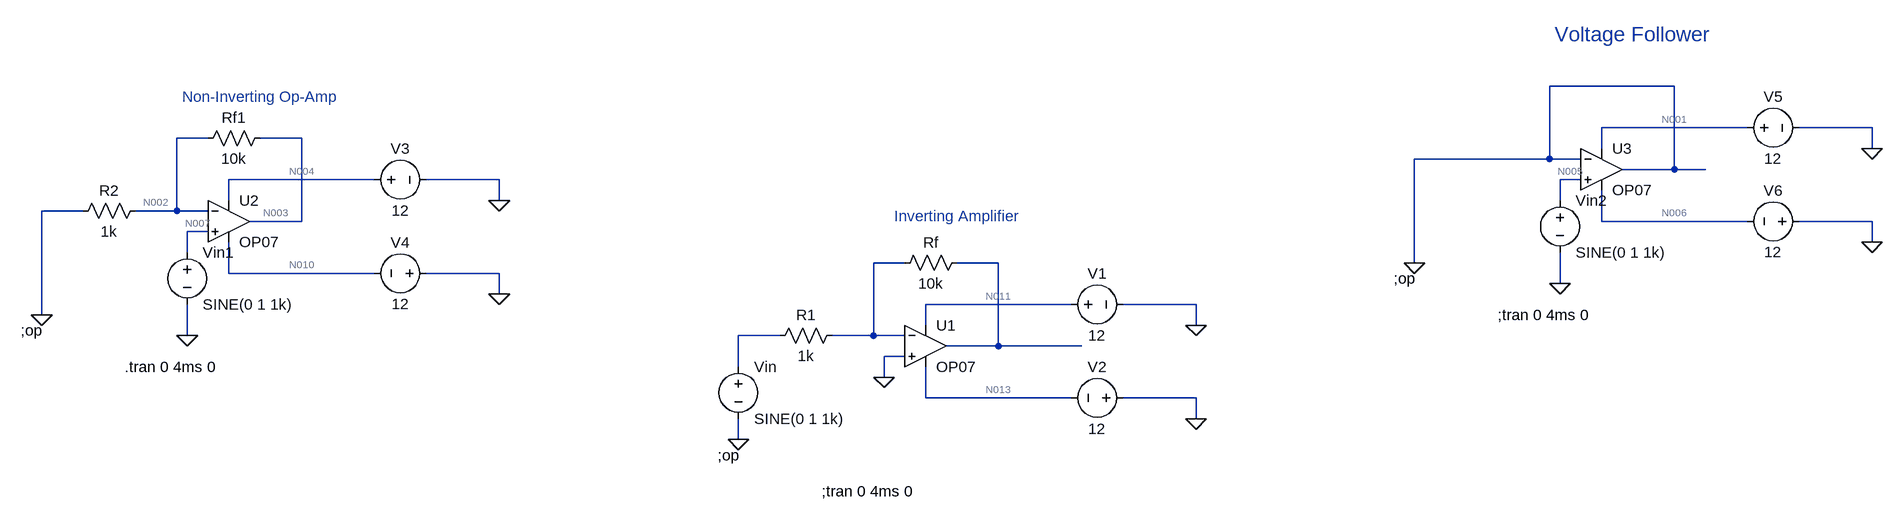
[diagram p0: schematic Exp2.asc]
Exp2.asc, the LTspice schematic file:
Version 4
SHEET 1 1700 680
WIRE 1376 -208 1184 -208
WIRE 1488 -144 1264 -144
WIRE 1680 -144 1568 -144
WIRE -880 -128 -928 -128
WIRE -736 -128 -800 -128
WIRE 1264 -112 1264 -144
WIRE 1680 -112 1680 -144
WIRE 1184 -96 1184 -208
WIRE 1184 -96 976 -96
WIRE 1232 -96 1184 -96
WIRE 1376 -80 1376 -208
WIRE 1376 -80 1296 -80
WIRE 1424 -80 1376 -80
WIRE -624 -64 -848 -64
WIRE -432 -64 -544 -64
WIRE 1232 -64 1200 -64
WIRE -848 -32 -848 -64
WIRE -432 -32 -432 -64
WIRE 1200 -32 1200 -64
WIRE -1072 -16 -1136 -16
WIRE -928 -16 -928 -128
WIRE -928 -16 -992 -16
WIRE -880 -16 -928 -16
WIRE -736 0 -736 -128
WIRE -736 0 -816 0
WIRE 1264 0 1264 -48
WIRE 1488 0 1264 0
WIRE 1680 0 1568 0
WIRE -880 16 -912 16
WIRE 1680 32 1680 0
WIRE -912 48 -912 16
WIRE 192 64 144 64
WIRE 336 64 272 64
WIRE 976 64 976 -96
WIRE -848 80 -848 32
WIRE -624 80 -848 80
WIRE -432 80 -544 80
WIRE 1200 96 1200 48
WIRE -432 112 -432 80
WIRE 448 128 224 128
WIRE 640 128 528 128
WIRE -1136 144 -1136 -16
WIRE 224 160 224 128
WIRE 640 160 640 128
WIRE -912 176 -912 128
WIRE 0 176 -64 176
WIRE 144 176 144 64
WIRE 144 176 80 176
WIRE 192 176 144 176
WIRE 336 192 336 64
WIRE 336 192 256 192
WIRE 464 192 336 192
WIRE 192 208 160 208
WIRE -64 224 -64 176
WIRE 160 240 160 208
WIRE 224 272 224 224
WIRE 448 272 224 272
WIRE 640 272 528 272
WIRE 640 304 640 272
WIRE -64 336 -64 304
FLAG 160 240 0
FLAG -64 336 0
FLAG 640 160 0
FLAG 640 304 0
FLAG -1136 144 0
FLAG -432 -32 0
FLAG -432 112 0
FLAG -912 176 0
FLAG 976 64 0
FLAG 1680 -112 0
FLAG 1680 32 0
FLAG 1200 96 0
SYMBOL res 288 48 R90
WINDOW 0 0 56 VBottom 2
WINDOW 3 32 56 VTop 2
SYMATTR InstName Rf
SYMATTR Value 10k
SYMBOL voltage -64 208 R0
WINDOW 123 0 0 Left 0
WINDOW 39 0 0 Left 0
SYMATTR InstName Vin
SYMATTR Value SINE(0 1 1k)
SYMBOL voltage 432 128 R270
WINDOW 0 32 56 VTop 2
WINDOW 3 -32 56 VBottom 2
WINDOW 123 0 0 Left 0
WINDOW 39 0 0 Left 0
SYMATTR InstName V1
SYMATTR Value 12
SYMBOL voltage 544 272 R90
WINDOW 0 -32 56 VBottom 2
WINDOW 3 32 56 VTop 2
WINDOW 123 0 0 Left 0
WINDOW 39 0 0 Left 0
SYMATTR InstName V2
SYMATTR Value 12
SYMBOL OpAmps\\OP07 224 128 R0
SYMATTR InstName U1
SYMBOL res 96 160 R90
WINDOW 0 0 56 VBottom 2
WINDOW 3 32 56 VTop 2
SYMATTR InstName R1
SYMATTR Value 1k
SYMBOL res -784 -144 R90
WINDOW 0 0 56 VBottom 2
WINDOW 3 32 56 VTop 2
SYMATTR InstName Rf1
SYMATTR Value 10k
SYMBOL voltage -912 32 R0
WINDOW 123 0 0 Left 0
WINDOW 39 0 0 Left 0
SYMATTR InstName Vin1
SYMATTR Value SINE(0 1 1k)
SYMBOL voltage -640 -64 R270
WINDOW 0 32 56 VTop 2
WINDOW 3 -32 56 VBottom 2
WINDOW 123 0 0 Left 0
WINDOW 39 0 0 Left 0
SYMATTR InstName V3
SYMATTR Value 12
SYMBOL voltage -528 80 R90
WINDOW 0 -32 56 VBottom 2
WINDOW 3 32 56 VTop 2
WINDOW 123 0 0 Left 0
WINDOW 39 0 0 Left 0
SYMATTR InstName V4
SYMATTR Value 12
SYMBOL OpAmps\\OP07 -848 -64 R0
SYMATTR InstName U2
SYMBOL res -976 -32 R90
WINDOW 0 0 56 VBottom 2
WINDOW 3 32 56 VTop 2
SYMATTR InstName R2
SYMATTR Value 1k
SYMBOL voltage 1200 -48 R0
WINDOW 123 0 0 Left 0
WINDOW 39 0 0 Left 0
SYMATTR InstName Vin2
SYMATTR Value SINE(0 1 1k)
SYMBOL voltage 1472 -144 R270
WINDOW 0 32 56 VTop 2
WINDOW 3 -32 56 VBottom 2
WINDOW 123 0 0 Left 0
WINDOW 39 0 0 Left 0
SYMATTR InstName V5
SYMATTR Value 12
SYMBOL voltage 1584 0 R90
WINDOW 0 -32 56 VBottom 2
WINDOW 3 32 56 VTop 2
WINDOW 123 0 0 Left 0
WINDOW 39 0 0 Left 0
SYMATTR InstName V6
SYMATTR Value 12
SYMBOL OpAmps\\OP07 1264 -144 R0
SYMATTR InstName U3
TEXT -96 360 Left 2 !;op
TEXT 64 416 Left 2 !;tran 0 4ms 0
TEXT -1168 168 Left 2 !;op
TEXT -1008 224 Left 2 !.tran 0 4ms 0
TEXT 944 88 Left 2 !;op
TEXT 1104 144 Left 2 !;tran 0 4ms 0
TEXT 1192 -288 Left 3 ;Voltage Follower
TEXT -920 -192 Left 2 ;Non-Inverting Op-Amp
TEXT 176 -8 Left 2 ;Inverting Amplifier

The netlist it stands for:
* Exp2.asc
Rf N009 N008 10k
Vin N012 0 SINE(0 1 1k)
V1 N011 0 12
V2 0 N013 12
XU1 0 N008 N011 N013 N009 LT1001  ; OP07, pins In+ In- V+ V- OUT
R1 N008 N012 1k
Rf1 N003 N002 10k
Vin1 N007 0 SINE(0 1 1k)
V3 N004 0 12
V4 0 N010 12
XU2 N007 N002 N004 N010 N003 LT1001  ; OP07, pins In+ In- V+ V- OUT
R2 N002 0 1k
Vin2 N005 0 SINE(0 1 1k)
V5 N001 0 12
V6 0 N006 12
XU3 N005 0 N001 N006 0 LT1001  ; OP07, pins In+ In- V+ V- OUT
;op
;tran 0 4ms 0
;op
.tran 0 4ms 0
;op
;tran 0 4ms 0
* Voltage Follower
* Non-Inverting Op-Amp
* Inverting Amplifier
.lib LTC.lib
.backanno
.end

* Results of the author's LTspice run, read from the files saved beside the schematic
* Operating Point, zero values left out:
*   V(n011) = 12 V
*   V(n013) = -12 V
*   V(n004) = 12 V
*   V(n010) = -12 V
*   V(n001) = 12 V
*   V(n006) = -12 V
*   I(V1) = -2.25 mA
*   I(V2) = -2.25 mA
*   I(V3) = -2.25 mA
*   I(V4) = -2.25 mA
*   I(V5) = -2.25 mA
*   I(V6) = -2.25 mA
*   Ix(u1:3) = 2.25 mA
*   Ix(u1:4) = -2.25 mA
*   Ix(u2:3) = 2.25 mA
*   Ix(u2:4) = -2.25 mA
*   Ix(u3:3) = 2.25 mA
*   Ix(u3:4) = -2.25 mA
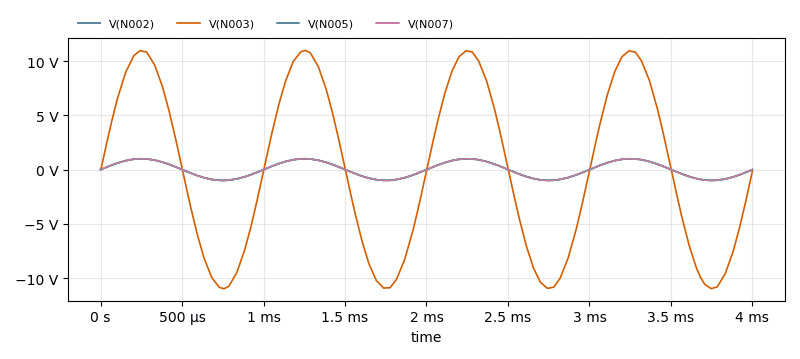
[diagram p1: Transient Analysis of Exp2.asc, plotted from the saved traces]
* Transient Analysis, 1 run:
*   V(N002): min -999 mV, max 999 mV, average -66.87 µV, rms 705.6 mV, last -13.28 mV
*   V(N003): min -10.99 V, max 10.99 V, average -735.6 µV, rms 7.761 V, last -146.1 mV
*   V(N005): min -999.9 mV, max 999.2 mV, average -76.78 µV, rms 705.7 mV, last 0 V
*   V(N007): min -999.9 mV, max 999.2 mV, average -76.78 µV, rms 705.7 mV, last 0 V